# Altium project slip-ring-pcb.PrjPcb
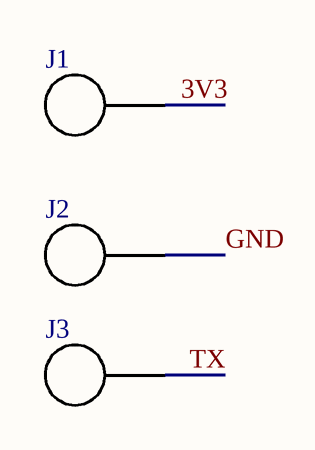
[diagram p0: sch.SchDoc]
1 sheet, 3 parts. Net scope: global (net labels, ports and power ports of the same name join across sheets).
Board file: slip-rings.PcbDoc

## Sheet sch.SchDoc
size 127 x 127 mm

### Parts
J1  pad single  [PAD_SING]  (value not drawn)
J2  pad single  [PAD_SING]  (value not drawn)
J3  pad single  [PAD_SING]  (value not drawn)

### Nets
3V3: J1.1
GND: J2.1
TX: J3.1

### Library data of the parts
J1-J3 = PAD-SING